# Altium schematic sheet controller.SchDoc
size A4; PageSetup: Record=PageOptions|CenterHorizontal=True|CenterVertical=True|PrintScale=0.86|XCorrection=1.00|YCorrection=1.00|PrintKind=0|BorderSize=5000000|LeftOffset=0|BottomOffset=0|Orientation=1|PaperLength=1000|PaperWidth=1000|Scale=100|PaperSource=7|PrintQuality=-3|MediaType=1|DitherType=10|PrintScaleMode=1|PaperKind=A4|PaperIndex=9
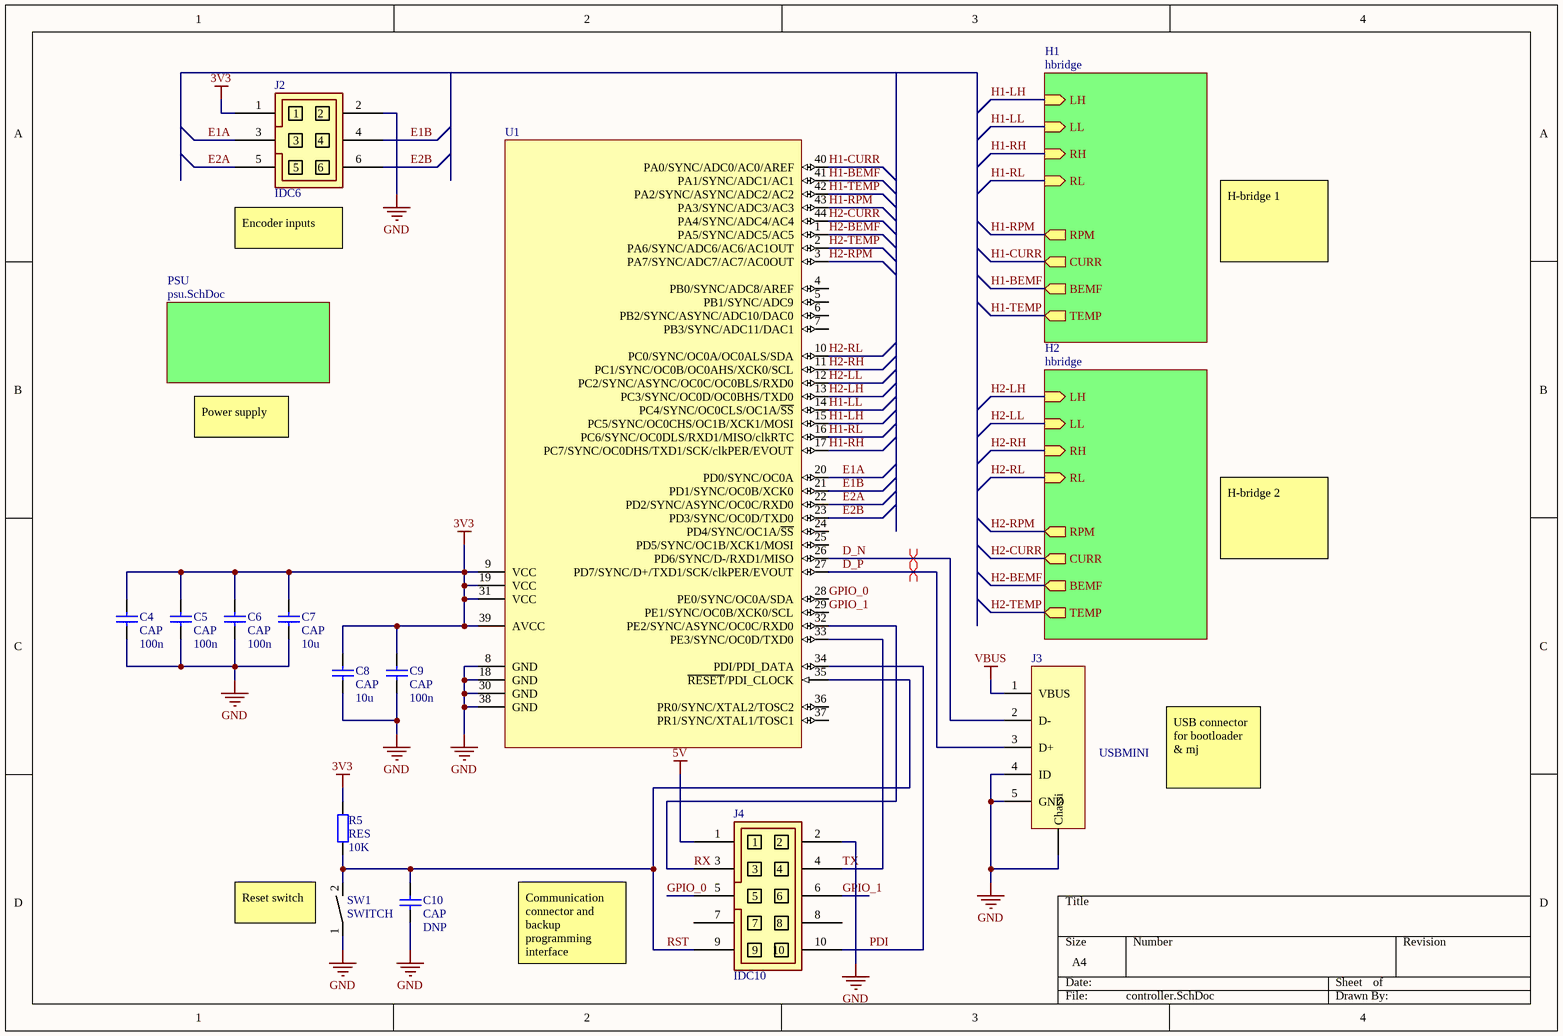
[diagram p0: controller.SchDoc]

## Parts
C4  CAP  value 100n  [CAPC1608X08M]
C5  CAP  value 100n  [CAPC1608X08M]
C6  CAP  value 100n  [CAPC1608X08M]
C7  CAP  value 10u  [CAPC1608X08M]
C8  CAP  value 10u  [CAPC2012X11M]
C9  CAP  value 100n  [CAPC1608X08M]
C10  CAP  value DNP  [CAPC1608X08M]
J2  IDC6  [IDC6]
J3  USBMINI  [MINI_USB]
J4  IDC10  [IDC10]
R5  RES  value 10K  [RESC1608X06M]
SW1  SWITCH  [Switch_pad]
U1  (no value)  [44A_N]

## Sub-sheets
H1 = hbridge: LH (in), LL (in), RH (in), RL (in), CURR (out), BEMF (out), TEMP (out), RPM (out)
H2 = hbridge: LH (in), LL (in), RH (in), RL (in), CURR (out), BEMF (out), TEMP (out), RPM (out)
PSU = psu.SchDoc: no entries

## Nets
3V3: C4.2 C5.2 C6.2 C7.2 C8.2 C9.2 J2.1 R5.2 U1.9(VCC) U1.19(VCC) U1.31(VCC) U1.39(AVCC)
5V: J4.1
GND: C4.1 C5.1 C6.1 C7.1 C8.1 C9.1 C10.1 J2.2 J3.4(ID) J3.5(GND) J3.C(Chassi) J4.2 SW1.1 U1.8(GND) U1.18(GND) U1.30(GND) U1.38(GND)
VBUS: J3.1(VBUS)
D_N: J3.2(D-) U1.26(PD6/SYNC/D-/RXD1/MISO)
D_P: J3.3(D+) U1.27(PD7/SYNC/D+/TXD1/SCK/clkPER/EVOUT)
E1A: J2.3 U1.20(PD0/SYNC/OC0A)
E1B: J2.4 U1.21(PD1/SYNC/OC0B/XCK0)
E2A: J2.5 U1.22(PD2/SYNC/ASYNC/OC0C/RXD0)
E2B: J2.6 U1.23(PD3/SYNC/OC0D/TXD0)
GPIO_0: J4.5 U1.28(PE0/SYNC/OC0A/SDA)
GPIO_1: J4.6 U1.29(PE1/SYNC/OC0B/XCK0/SCL)
H1-BEMF: U1.41(PA1/SYNC/ADC1/AC1) ; sheet H1/BEMF
H1-CURR: U1.40(PA0/SYNC/ADC0/AC0/AREF) ; sheet H1/CURR
H1-LH: U1.15(PC5/SYNC/OC0CHS/OC1B/XCK1/MOSI) ; sheet H1/LH
H1-LL: U1.14(PC4/SYNC/OC0CLS/OC1A/~{SS}) ; sheet H1/LL
H1-RH: U1.17(PC7/SYNC/OC0DHS/TXD1/SCK/clkPER/EVOUT) ; sheet H1/RH
H1-RL: U1.16(PC6/SYNC/OC0DLS/RXD1/MISO/clkRTC) ; sheet H1/RL
H1-RPM: U1.43(PA3/SYNC/ADC3/AC3) ; sheet H1/RPM
H1-TEMP: U1.42(PA2/SYNC/ASYNC/ADC2/AC2) ; sheet H1/TEMP
H2-BEMF: U1.1(PA5/SYNC/ADC5/AC5) ; sheet H2/BEMF
H2-CURR: U1.44(PA4/SYNC/ADC4/AC4) ; sheet H2/CURR
H2-LH: U1.13(PC3/SYNC/OC0D/OC0BHS/TXD0) ; sheet H2/LH
H2-LL: U1.12(PC2/SYNC/ASYNC/OC0C/OC0BLS/RXD0) ; sheet H2/LL
H2-RH: U1.11(PC1/SYNC/OC0B/OC0AHS/XCK0/SCL) ; sheet H2/RH
H2-RL: U1.10(PC0/SYNC/OC0A/OC0ALS/SDA) ; sheet H2/RL
H2-RPM: U1.3(PA7/SYNC/ADC7/AC7/AC0OUT) ; sheet H2/RPM
H2-TEMP: U1.2(PA6/SYNC/ADC6/AC6/AC1OUT) ; sheet H2/TEMP
PDI: J4.10 U1.34(PDI/PDI_DATA)
RST: C10.2 J4.9 R5.1 SW1.2 U1.35(~{RESET}/PDI_CLOCK)
RX: J4.3 U1.32(PE2/SYNC/ASYNC/OC0C/RXD0)
TX: J4.4 U1.33(PE3/SYNC/OC0D/TXD0)

Not connected (* = marked no-connect by the designer): J4 7 8; U1 4(PB0/SYNC/ADC8/AREF) 5(PB1/SYNC/ADC9) 6(PB2/SYNC/ASYNC/ADC10/DAC0) 7(PB3/SYNC/ADC11/DAC1) 24(PD4/SYNC/OC1A/~{SS}) 25(PD5/SYNC/OC1B/XCK1/MOSI) 36(PR0/SYNC/XTAL2/TOSC2) 37(PR1/SYNC/XTAL1/TOSC1)

## Layout directives
differential pair: D_N, D_P

## Notes on the sheet
- (near J2) Encoder inputs
- H-bridge 1
- Power supply
- H-bridge 2
- USB connector for bootloader & mj
- (near SW1) Reset switch
- Communication connector and backup programming interface

## Library data of the parts
C4-C10 = CAP: Capacitor; Published: 8-Jun-2000; LatestRevisionDate: 17-Jul-2002; LatestRevisionNote: Re-released for DXP Platform.; PackageReference: RB7.6-15; Publisher: Altium Limited; PackageDescription: Polarized Capacitor (Radial); 2 Leads
J2 = IDC6: 6pin IDC connector
J3 = MINI_USB
J4 = IDC10: 10pin IDC connector
R5 = RES: Resistor; Published: 8-Jun-2000; LatestRevisionDate: 17-Jul-2002; LatestRevisionNote: Re-released for DXP Platform.; PackageReference: AXIAL-0.4; Publisher: Altium Limited; PackageDescription: Axial Device, Thru-Hole; 2 Leads; 0.4 in Pin Spacing
U1 = ATxmega32A4U-AU: 8/16-bit AVR XMEGA A4U Microcontroller, 1.6-3.6V, 32MHz, 32K + 4KB Flash, 1K EEPROM, 4K SRAM, 44-pin TQFP, Industrial Grade (-40°C to 85°C); DatasheetVersion: revB, Dec-2011; PackageVersion: revC, Oct-2010; PackageReference: 44A; PackageDescription: 44-Pin Plastic Thin Profile Quad Flat Pack, 10 x 10 x 1.0 mm Body, 0.8 mm Pitch (TQFP); Code_JEDEC: MS-026-ACB; ComponentLink1Description: Manufacturer URL; ComponentLink1URL: http://www.atmel.com/; ComponentLink2Description: ATxmega16A4U/32A4U/64A4U/128A4U Datasheet; ComponentLink2URL: http://www.atmel.com/dyn/resources/prod_documents/doc8387.pdf